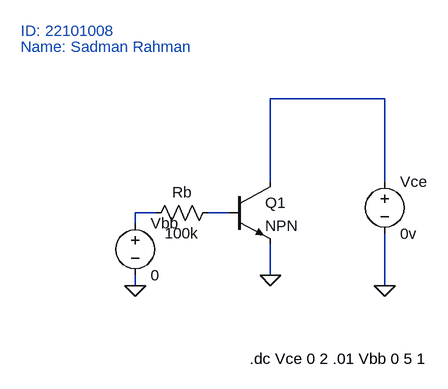
[diagram p0: schematic Task-3.asc]
Task-3.asc, the LTspice schematic file:
Version 4
SHEET 1 880 680
WIRE 480 -32 304 -32
WIRE 304 96 304 -32
WIRE 480 96 480 -32
WIRE 128 144 96 144
WIRE 240 144 208 144
WIRE 96 160 96 144
WIRE 304 240 304 192
WIRE 96 256 96 240
WIRE 480 256 480 176
FLAG 96 256 0
FLAG 304 240 0
FLAG 480 256 0
SYMBOL npn 240 96 R0
SYMATTR InstName Q1
SYMBOL voltage 96 144 R0
SYMATTR InstName Vbb
SYMATTR Value 0
SYMBOL voltage 480 80 R0
SYMATTR InstName Vce
SYMATTR Value 0v
SYMBOL res 224 128 R90
WINDOW 0 0 56 VBottom 2
WINDOW 3 32 56 VTop 2
SYMATTR InstName Rb
SYMATTR Value 100k
TEXT 272 368 Left 2 !.dc Vce 0 2 .01 Vbb 0 5 1
TEXT -80 -136 Left 2 ;ID: 22101008
TEXT -80 -112 Left 2 ;Name: Sadman Rahman

The netlist it stands for:
* Task-3.asc
Q1 N001 N003 0 0 NPN
Vbb N002 0 0
Vce N001 0 0v
Rb N003 N002 100k
.model NPN NPN
.model PNP PNP
.lib standard.bjt
.dc Vce 0 2 .01 Vbb 0 5 1
* ID: 22101008
* Name: Sadman Rahman
.backanno
.end